# Altium schematic sheet USB Connector.SchDoc
size A4; SheetNumber: 5; SheetTotal: 7
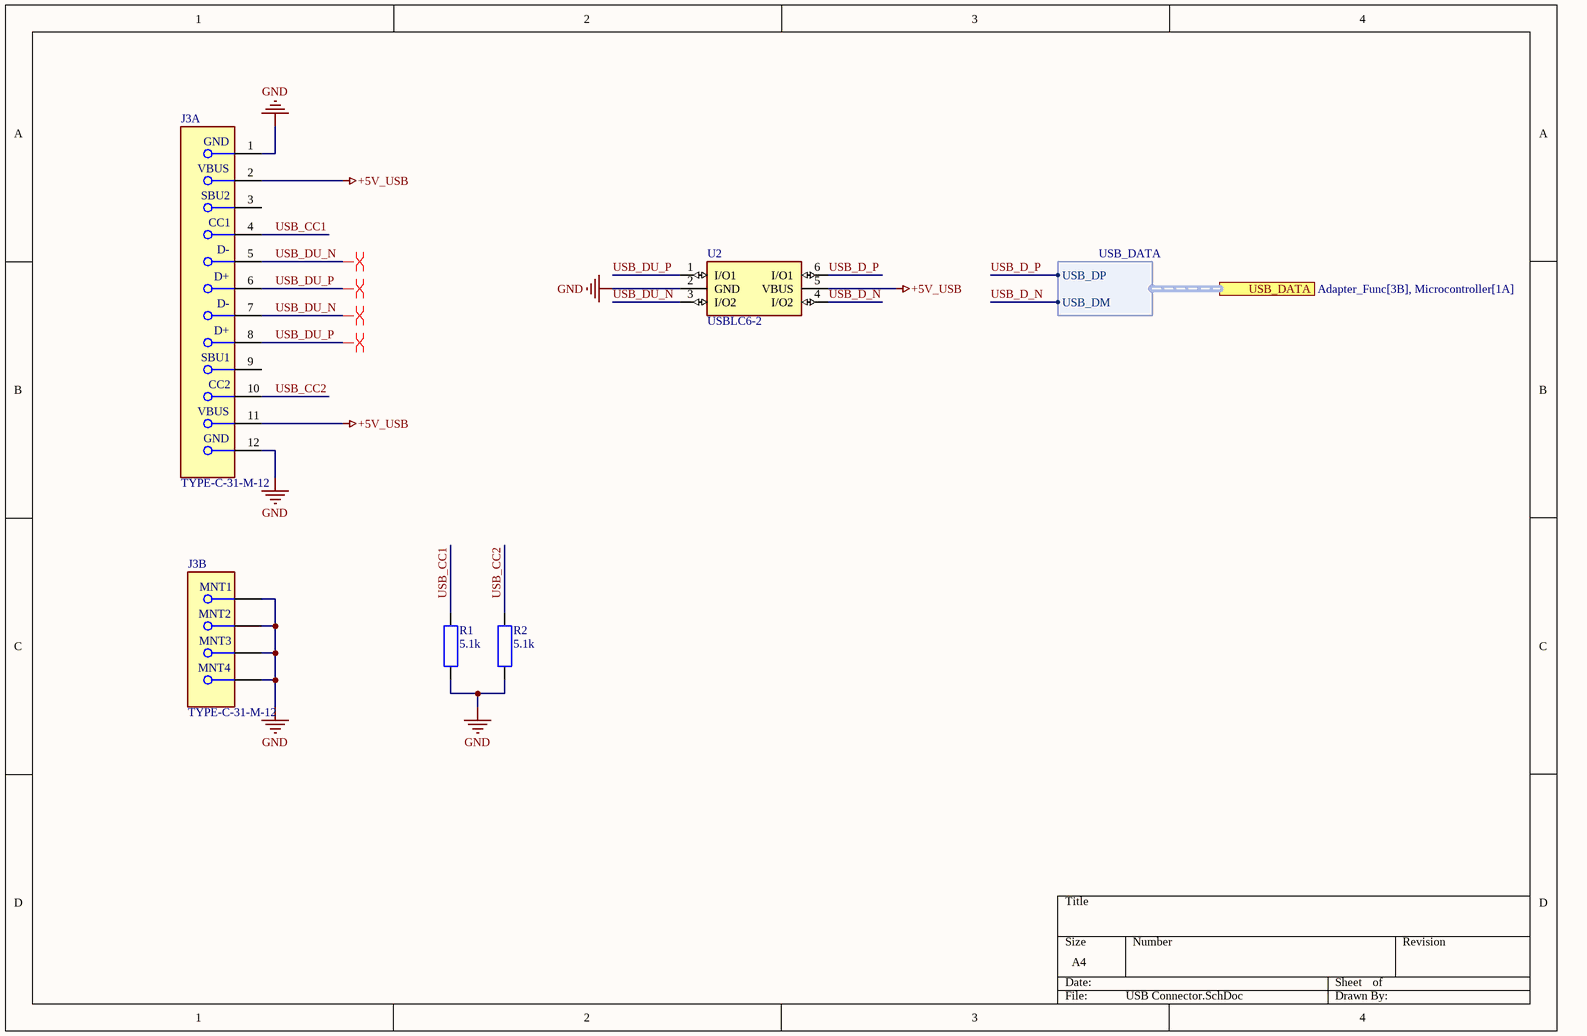
[diagram p0: USB Connector.SchDoc]

## Parts
J3  TYPE-C-31-M-12  [TYPE-C-31-M-12]  (parts A,B of 2)
R1  5.1k  [0603 SMD Res]
R2  5.1k  [0603 SMD Res]
U2  USBLC6-2  [SOT23-6L]

## Ports
USB_DATA (harness USB_DATA, see Adapter_Func[3B], Microcontroller[1A])

## Harnesses
USB_DATA: USB_DP, USB_DM

## Nets
+5V_USB: J3.2 J3.11 U2.5(VBUS)
GND: J3.1 J3.12 J3.13 J3.14 J3.15 J3.16 R1.1 R2.1 U2.2(GND)
USB_CC1: J3.4 R1.2
USB_CC2: J3.10 R2.2
USB_D_N: U2.4(I/O2) ; port USB_DATA.USB_DM
USB_D_P: U2.6(I/O1) ; port USB_DATA.USB_DP
USB_DU_N: J3.5 J3.7 U2.3(I/O2)
USB_DU_P: J3.6 J3.8 U2.1(I/O1)

Not connected (* = marked no-connect by the designer): J3 3 9

## Layout directives
differential pair: USB_DU_N, USB_DU_P

## Notes on the sheet
- (in symbol USB-C Receptable Top Mount TYPE-C-31-M-12, part A) GND; VBUS; SBU2; CC1; D-; D+; SBU1; CC2
- (in symbol USB-C Receptable Top Mount TYPE-C-31-M-12, part B) MNT1; MNT2; MNT3; MNT4

## Library data of the parts
J3 = USB-C Receptable Top Mount TYPE-C-31-M-12: 5A 1 16 Female Type-C SMD USB Connectors ROHS; ComponentLink1Description: Datasheet; ComponentLink1URL: https://datasheet.lcsc.com/lcsc/2205251630_Korean-Hroparts-Elec-TYPE-C-31-M-12_C165948.pdf; Pin Count: 12; Part Number: TYPE-C-31-M-12
R1 R2 = Resistor 5.1k 0603 1%: Part Number: RC0603FR-075K1L; ComponentLink1Description: ChipDip; ComponentLink1URL: https://www.chipdip.ru/product/0.1w-0603-5.1-kom-1
U2 = USB ESD Protection IC USBLC6-2: Part Number: USBLC6-2SC6